# EAGLE design sub2 (EAGLE 4.13)
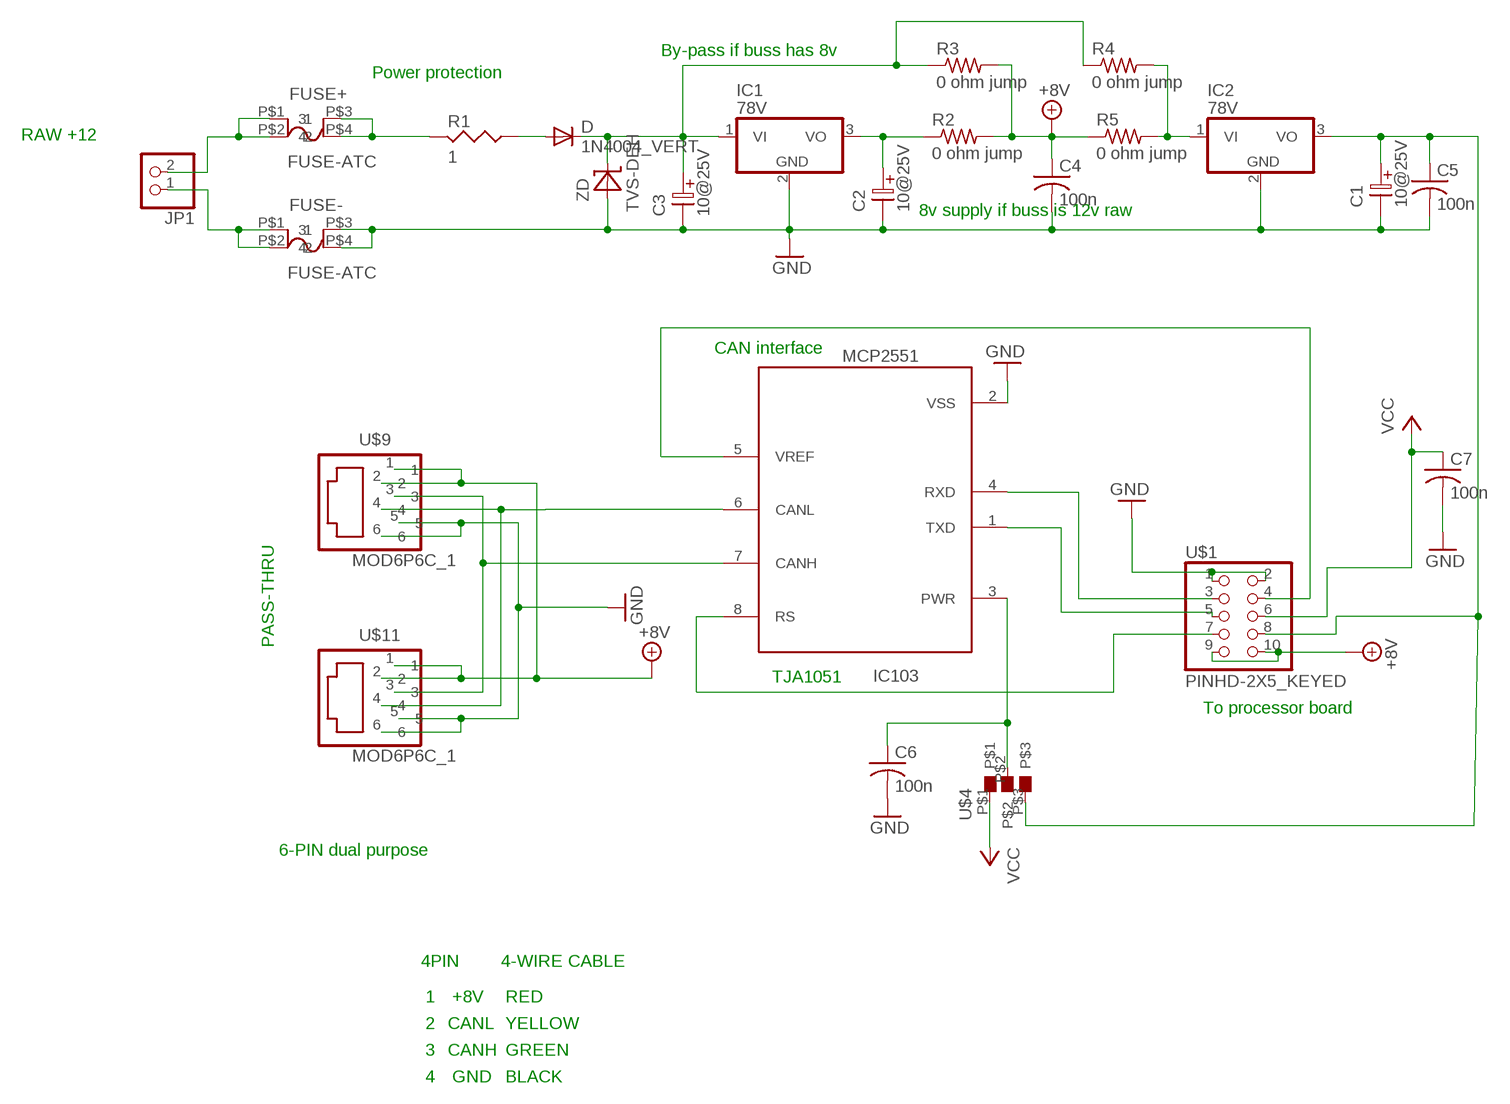
[diagram p0: schematic, sheet 1]

## Parts
C1  10@25V  ELC-2,5L  [ES-2,5L]
C2  10@25V  ELC-2,5L  [ES-2,5L]
C3  10@25V  ELC-2,5L  [ES-2,5L]
C4  100n  C-USC0603  [C0603]
C5  100n  C-USC0603  [C0603]
C6  100n  C-USC0603  [C0603]
C7  100n  C-USC0603  [C0603]
D  1N4004_VERT  [DO41-10_VERT]
FUSE+  FUSE-ATC  [ATC-FUSE]
FUSE-  FUSE-ATC  [ATC-FUSE]
IC1  78V  [TO220V]
IC2  78V  [TO220V]
IC103  MCP2551  [SO-08]
JP1  PINHD-1X2  [1X02]
R1  1  RESUS-S2,5  [RS-2,5]
R2  0 ohm jump  R-US_R0603  [R0603]
R3  0 ohm jump  R-US_R0603  [R0603]
R4  0 ohm jump  R-US_R0603  [R0603]
R5  0 ohm jump  R-US_R0603  [R0603]
U$1  PINHD-2X5_KEYED  [2X05_KEYED]
U$4  SMD-3  [SMD_3]
U$9  MOD6P6C_1  [MOD6P6C_1]
U$11  MOD6P6C_1  [MOD6P6C_1]
ZD  TVS-DEH  [TVS-DEH]

## Nets
5V_REG_VI: IC2.1(VI) R4.2 R5.2
12V_GND: FUSE-.P$1 FUSE-.P$2 JP1.1
12V_PLUS: FUSE+.P$1 FUSE+.P$2 JP1.2
+5V: C1.1 C5.1 IC2.3(VO) U$1.8 U$4.P$3
+8_REG: C2.1 IC1.3(VO) R2.1
+8V: C4.1 R2.2 R3.2 R5.1 U$1.9 U$1.10 U$9.1 U$9.2 U$11.1 U$11.2
+12V_RESISTORED: D.A R1.1
+12V_VI: C3.1 D.C IC1.1(VI) R3.1 R4.1 ZD.C
+12VFUSED: FUSE+.P$3 FUSE+.P$4 R1.2
CAN_DRVR_PWR: C6.1 IC103.3(PWR) U$4.P$2
CAN_RXD: IC103.4(RXD) U$1.3
CAN_TXD: IC103.1(TXD) U$1.5
CAN_VREF: IC103.5(VREF) U$1.4
CANH: IC103.7(CANH) U$9.3 U$11.3
CANL: IC103.6(CANL) U$9.4 U$11.4
GND: C1.2 C2.2 C3.2 C4.2 C5.2 C6.2 C7.2 FUSE-.P$3 FUSE-.P$4 IC1.2(GND) IC2.2(GND) IC103.2(VSS) U$1.1 U$1.2 U$9.5 U$9.6 U$11.5 U$11.6 ZD.A
PB7_CAN_RS: IC103.8(RS) U$1.7
VCC: C7.1 U$1.6 U$4.P$1

## Notes on the sheet
- By-pass if buss has 8v
- Power protection
- RAW +12
- 8v supply if buss is 12v raw
- CAN interface
- PASS-THRU
- TJA1051
- To processor board
- 6-PIN dual purpose
- 4PIN | 4-WIRE CABLE
- 1 | +8V | RED
- 2 | CANL | YELLOW
- 3 | CANH | GREEN
- 4 | GND | BLACK

## Library data of the parts
C1-C3 = DEH:ELC-2,5L
C4-C7 = rcl:C-US: CAPACITOR, American symbol
D = diode:1N4004_VERT
FUSE+ FUSE- = DEH:FUSE-ATC
IC1 IC2 = linear:78*: Positive VOLTAGE REGULATOR
IC103 = texas:MCP2551
JP1 = pinhead:PINHD-1X2: PIN HEADER
R1 = DEH:RESUS-S2,5
R2-R5 = rcl:R-US_: RESISTOR, American symbol
U$1 = pinhead:PINHD-2X5_KEYED
U$4 = solpad:SMD-3
U$9 U$11 = DEH:MOD6P6C_1
ZD = diode-1:TVS-DEH

## Board
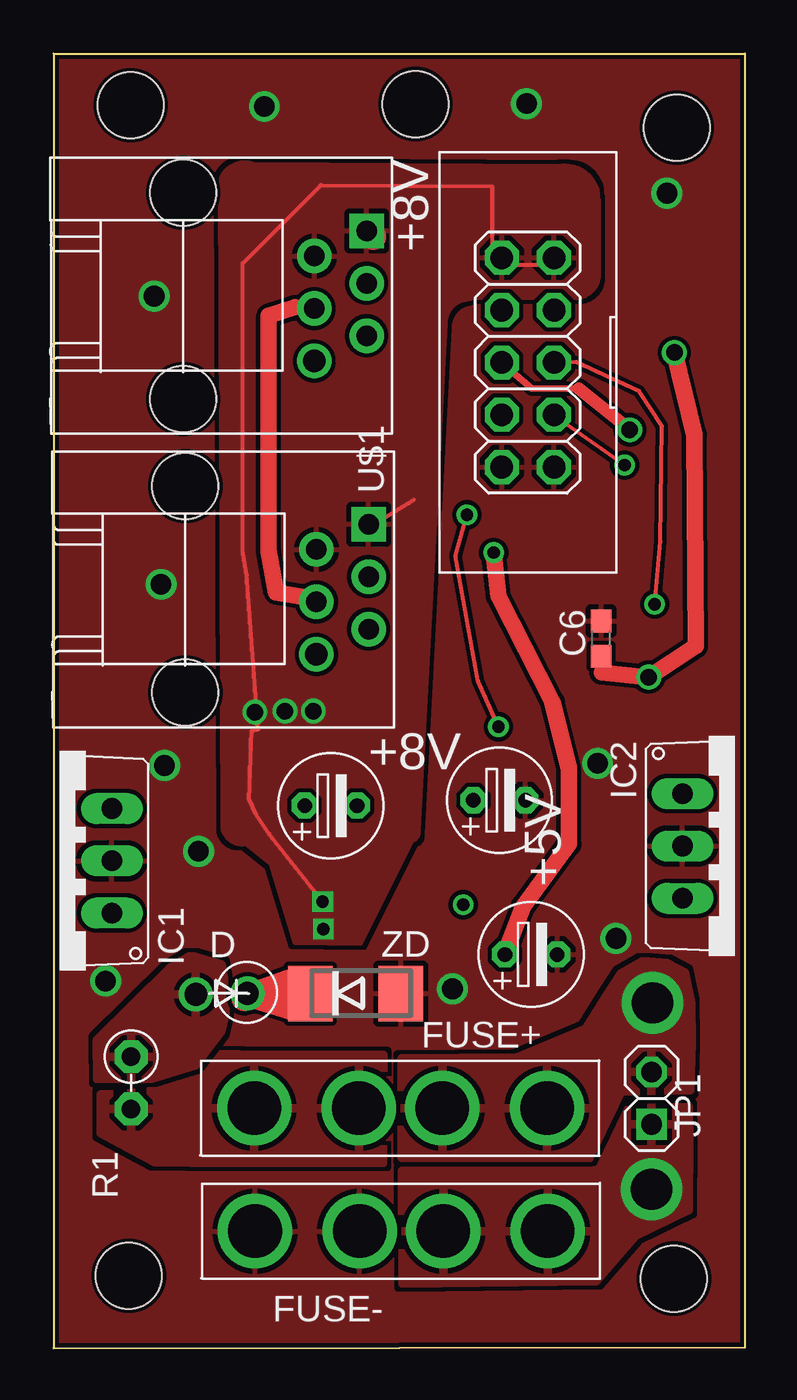
[diagram p1: board, top side]
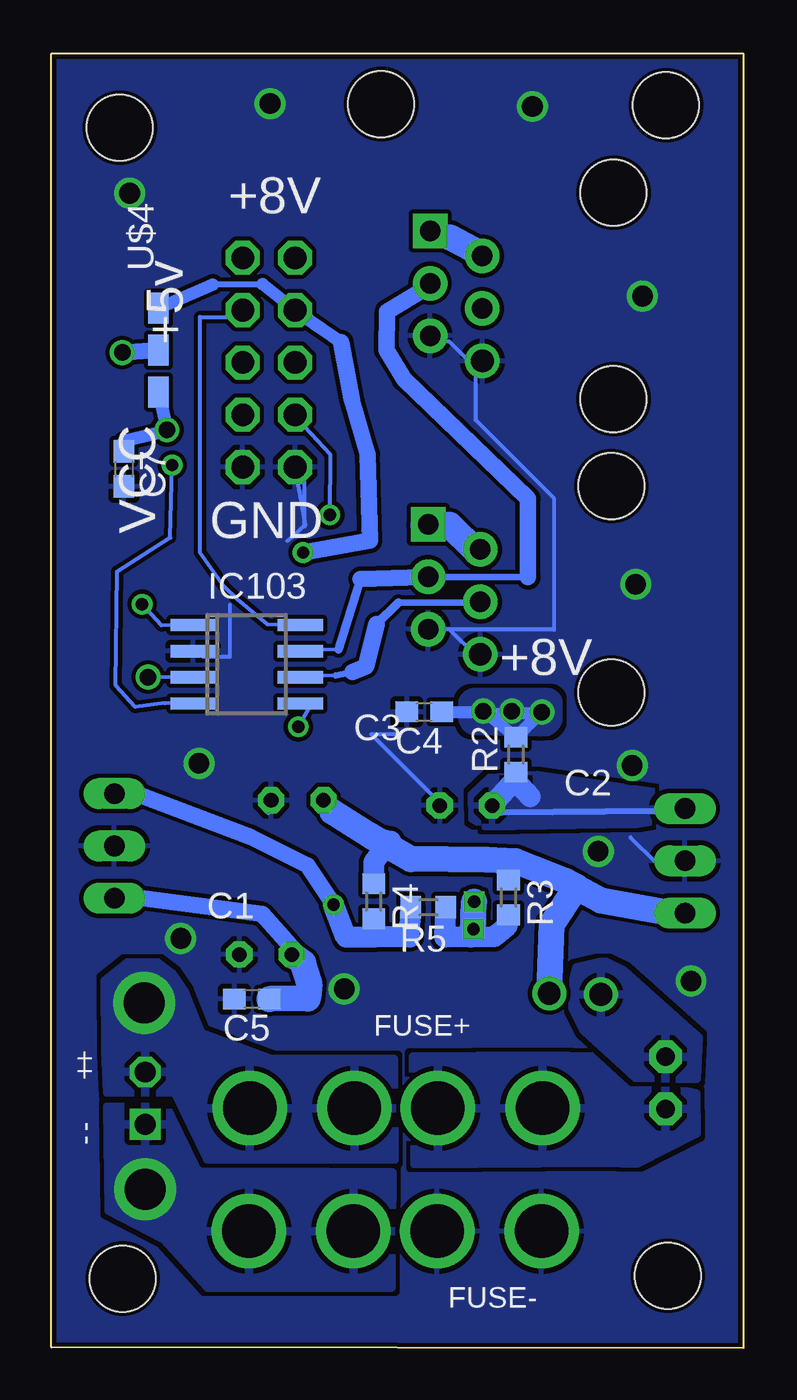
[diagram p2: board, bottom side, seen from below]

Size 33.6 x 62.86 mm. Coordinates in mm from the lower left corner, seen from the top.
Outline: 0,62.86 0,0 33.6,0.03 33.6,62.86 0,62.86
Copper layers (1*16): Top 0.035mm / dielectric 1.5mm / Bottom 0.035mm
Design rules "default": minimum track width 8mil, minimum drill 0.6mm, track to track 8mil, track to pad 8mil, pad to pad 8mil, via to via 8mil, smd to smd 0mil, copper to edge 8mil, drill to drill 8mil, minimum pad ring 8mil, minimum via ring 8mil, stop-mask expansion 4mil, vias tented up to drill 0mil, thermal gap 10mil
Holes 3.2 mm at 3.66,3.51 3.75,60.35 30.28,59.26 30.14,3.37 17.59,60.41

### Footprints (pad centres in the part's own frame; a part is rotated, then mirrored left to right if it is on the bottom)
ES-2,5L = drill 0.711 pad 1.27 octagon: 1 0,0; 2 2.54,0
C0603 = smd 1.1 x 1: 1 -0.85,0; 2 0.85,0
DO41-10_VERT = drill 1.1 round: A 2.58,0.05; C 0.07,0
ATC-FUSE = drill 2.6 round: P$1 -2.03,0; P$2 -7.11,0; P$3 2.03,0; P$4 7.11,0
TO220V = drill 1 long: 1 -2.54,1.27; 2 0,1.27; 3 2.54,1.27
SO-08 = smd 0.6 x 2.2: 1 -1.905,-2.6; 2 -0.635,-2.6; 3 0.635,-2.6; 4 1.905,-2.6; 5 1.905,2.6; 6 0.635,2.6; 7 -0.635,2.6; 8 -1.905,2.6
1X02 = drill 1 square: 1 -1.27,0 | drill 1 octagon: 2 1.27,0
RS-2,5 = drill 0.9 pad 1.6 octagon: 1 0,0; 2 2.54,0
R0603 = smd 1 x 1.1: 1 -0.85,0; 2 0.85,0
2X05_KEYED = drill 1.1 octagon: 1 -5.08,-1.27; 2 -5.08,1.27; 3 -2.54,-1.27; 4 -2.54,1.27; 5 0,-1.27; 6 0,1.27; 7 2.54,-1.27; 8 2.54,1.27; 9 5.08,-1.27; 10 5.08,1.27
SMD_3 = smd 1.5 x 1: P$1 -2.04,-0.27; P$2 0,-0.27; P$3 2.04,-0.27
MOD6P6C_1 = drill 1 pad 1.676 square: 1 -3.175,8.898 | drill 1 pad 1.676 round: 2 -1.951,6.358; 3 -0.627,8.898; 4 0.597,6.358; 5 1.921,8.898 | drill 1.1 pad 1.676 round: 6 3.145,6.358 | hole 3.2: -5.029,-0.01; 4.999,-0.01
TVS-DEH = smd 2.16 x 2.7: A 2.19,-0.05; C -2.2,-0.05

### Placement (x,y rotation side)
C1  21.93,19.11 0 top
C2  12.2,26.34 0 top
C3  20.39,26.6 0 top
C4  15.49,30.89 180 bottom
C5  23.86,16.95 180 bottom
C6  26.6,34.45 90 top
C7  30.09,42.69 270 bottom
D  9.49,17.22 180 top
FUSE+  16.86,11.64 180 top
FUSE-  16.9,5.67 180 top
IC1  4.1,23.66 90 top
IC2  29.28,24.38 270 top
IC103  24.12,33.21 270 bottom
JP1  29.05,12.13 90 top
R1  3.77,14.15 270 top
R2  11.04,28.82 90 bottom
R3  11.4,21.88 270 bottom
R4  17.95,21.69 270 bottom
R5  15.29,21.4 180 bottom
U$1  23.04,47.86 90 top
U$4  28.67,48.46 90 bottom
U$9  6.41,36.83 270 top
U$11  6.31,51.08 270 top
ZD  14.68,17.26 0 top

### Tracks (layer width: path | path; a pad name or v marks a point on that pad's centre or on a via)
5V_REG_VI  (via drill 0.6)
  Bottom 0.813: v19.9,21.53 21.16,23.44 23.93,24.83 29.31,26.86 IC2.1
  Bottom 1.016: 17.92,19.95 R4.2 | 17.92,19.95 19.28,19.95 19.89,21.51 v19.9,21.53 | R5.2 16.2,19.96 17.92,19.97 17.92,19.95
12V_GND  (via drill 2)
  other vias: 29.05,7.71
  pour Top (rank 3): 27.89,11.67 26.3,8.6 16.93,8.6 16.96,3.12 26.38,3.25 28.27,5.43 30.87,6.68 30.88,10.24 30.86,11.72
  pour Bottom (rank 3): 17.03,8.54 26.29,8.6 27.95,11.71 30.89,11.73 30.82,6.67 28.16,5.29 25.99,2.9 17.09,2.93
12V_PLUS  (via drill 2)
  other vias: 29.1,16.76
  pour Top: 30.92,12.51 27.59,12.44 26.02,9.21 16.9,9.24 16.9,14.07 22.49,14.11 25.87,15.51 26.87,17.16 27.56,18.18 28.62,18.8 29.79,18.71 30.66,18.24 30.99,16.74 31,14.85
  pour Bottom (rank 2): 16.97,14.04 23.02,14.07 26.31,15.28 27.09,17.23 27.76,18.21 28.45,18.72 29.92,18.72 31.02,17.86 30.98,14.43 30.9,12.4 27.62,12.41 26.04,9.17 16.94,9.14
+5V  (via drill 0.6)
  Top 0.203: C1.1 21.96,19.21
  Top 0.813: v21.38,38.63 21.61,36.51 24.24,31.36 25.03,28.14 25.04,24.47 22.8,21.43 21.96,19.21
  Bottom 0.203: C1.1 22.01,19.54 | 30.38,22 IC2.3 | 21.3,50.07 U$1.8 21.79,50.43
  Bottom 0.305: 23.35,51.66 25.77,51.64
  Bottom 0.61: 19.53,48.84 21.3,50.07 | 25.77,51.64 U$4.P$3 | 21.79,50.43 23.35,51.66
  Bottom 0.813: 22.01,19.54 23.37,21.08 30.38,22 | 19.53,48.84 18.99,46 18.24,43.41 18.13,39.2 v21.38,38.63
  Bottom 1.27: C5.1 21.14,16.97 21.07,17.71 21.37,18.71 C1.1
+8_REG
  Bottom 0.203: 11.72,26 C2.1 | IC1.3 4.2,26.07 | 10.34,26.77 R2.1
  Bottom 0.305: 4.2,26.07 11.72,26
  Bottom 1.016: C2.1 11.08,27.59 10.34,26.77
  pour Bottom: 3.88,25.63 5.17,25.4 12.55,25.28 13.21,25.67 13.22,26.91 12.35,27.74 10.03,27.87 4.16,27.02 3.73,26.43
+8V  (via drill 0.6, 0.8)
  Top 0.203: 9.94,30.06 9.39,37.55 9.18,38.7 9.18,52.67 12.99,56.48 21.3,56.42 21.3,52.61 U$1.10 22.57,52.61 23.84,52.61 U$1.9 | 9.94,30.06 v9.78,30.88 | 17.49,41.18 15.53,39.97 U$9.1 | 9.94,30.06 9.63,29.96 9.5,26.63 9.85,25.91 10.48,24.97 v13.07,21.68
  Top 1.27: U$11.1 15.54,53.95
  Bottom 0.203: U$9.2 12.99,38.7 | 15.53,39.97 U$9.1 | 14.26,53.94 15.53,53.94 U$11.1 | 13.23,19.95 13.12,20.17 13.12,20.19 v13.1,20.34
  Bottom 0.61: v9.78,30.88 R2.2 12.45,30.78 9.63,30.84 | v12.62,30.93 12.55,30.86 C4.1
  Bottom 1.016: R5.1 14.49,19.96 13.23,19.95 12.1,19.97 11.46,20.5 R3.2
  Bottom 1.27: 12.99,38.7 14.26,39.97 15.53,39.97 | 14.26,53.94 12.86,53.19 U$11.2 | 13.12,20.17 v13.07,21.68
  other vias: 11.24,30.93
  pour Top (rank 4): 9.66,57.52 24.56,57.41 arc-90 26.44,56.08 26.44,55.77 26.49,55.77 26.49,52.14 arc-90 25.33,50.98 20.24,50.98 20.24,50.93 arc90 19.03,49.72 17.72,25.14 arc-90 17.42,24.63 14.9,19.61 11.74,19.65 10.57,23.49 9.32,24.48 arc-90 8.22,25.22 8.1,56.71 arc-90
  pour Bottom (rank 4): 9.82,30 arc-90 9.07,30.55 9.06,31.28 arc-90 9.5,31.75 13.06,31.75 arc-90 13.56,31.23 13.53,30.54 arc-90 12.95,30.06
+12V_RESISTORED
  pour Bottom: 2.15,15.09 5.79,18.33 6.75,18.79 8.1,18.48 8.49,16.87 7.73,15.4 5.23,13.11 3.38,13.08 2.25,13.07
  pour Top: 2.1,14.95 5.69,18.48 6.67,19.06 8.16,18.62 8.47,16.8 8.14,15.36 6.91,13.72 4.76,13.06 2.11,13.05
+12V_VI
  Top 1.27: ZD.C 12.32,17.76 11.49,17.78 | 11.49,17.78 9.26,16.98 | 11.49,17.78 11.63,16.53 D.C
  Bottom 0.61: 19.95,26.04 C3.1 | 3.78,21.17 IC1.1
  Bottom 1.016: 12.47,23.7 11.19,23.75 R3.1 | R4.1 17.95,23.57 17.12,24.62 18.09,24.87
  Bottom 1.27: 19.95,26.04 18.09,24.87 16.15,23.75 12.47,23.7 11.05,23.64 8.64,22.69 8.1,22.39 | 3.78,21.17 6.9,21.73 8.1,22.39 | D.C 9.29,20.58 8.11,22.37 8.1,22.39
+12VFUSED
  pour Top (rank 2): 2.28,12.31 3.44,12.37 4.89,12.5 5.58,12.9 6.43,14.21 7.14,14.26 9.03,14.26 9.82,14.23 16.04,14.23 16.01,8.97 6.65,9 4.91,9.01 2.28,10.42
  pour Bottom (rank 2): 16.03,14.16 15.97,8.93 6.75,8.99 5.16,8.94 2.26,10.42 2.27,12.36 4.8,12.91 5.79,13.09 6.99,14.16 9.87,14.22
CAN_DRVR_PWR  (via drill 0.8)
  Top 0.406: 26.63,32.81 C6.1 | v28.91,32.58 28.94,32.56
  Top 0.813: v28.91,32.58 31.19,34.08 31.13,44.35 v30.16,48.34 | 28.94,32.56 26.63,32.81
  Bottom 0.203: IC103.3 v28.91,32.58 | 28.51,48.45 U$4.P$2
  Bottom 0.813: v30.16,48.34 28.51,48.45
CAN_RXD  (via drill 0.6)
  Top 0.203: U$1.3 24.23,45.33 v27.74,42.88
  Bottom 0.203: IC103.4 28.1,31.32 29.53,31.13 30.47,32.17 30.42,37.7 27.83,39.35 v27.74,42.88
CAN_TXD  (via drill 0.6)
  Top 0.203: v29.2,36.12 29.48,39.17 29.55,44.76 28.44,46.48 25.39,47.88 U$1.5
  Bottom 0.203: v29.2,36.12 28.26,35.09 IC103.1
CAN_VREF  (via drill 0.6)
  Top 0.203: v21.61,30.17 20.62,32.4 19.53,38.46 v20.08,40.46
  Bottom 0.203: v21.61,30.17 21.12,31.02 IC103.5 | v20.08,40.46 20.05,43.38 21.3,44.74 U$1.4
CANH
  Bottom 0.203: 19.65,33.91 21.14,33.89 IC103.7 | 15.53,37.43 U$9.3
  Bottom 0.305: 10.45,37.43 15.53,37.43 | 15.53,51.4 U$11.3
  Bottom 0.406: 18.58,37.35 19.65,33.91
  Bottom 0.813: 15.53,37.43 18.58,37.35 | 15.53,51.4 17.3,50.33 17.33,48.47 16.48,47.04 10.45,41.24 10.45,37.43
CANL
  Top 0.203: 12.6,36.4 U$9.4
  Top 0.406: 11.73,50.54 U$11.4
  Top 0.813: 11.73,50.54 10.45,50.13 10.45,38.7 10.82,36.69 12.6,36.4
  Bottom 0.203: 19.8,32.65 21.09,32.6 IC103.6 | U$9.4 13.01,36.2
  Bottom 0.305: 18.98,32.82 19.8,32.65 | 13.01,36.2 16.74,36.2
  Bottom 0.406: 16.74,36.2 17.8,35.15
  Bottom 0.813: 18.98,32.82 18.33,33.1 17.8,35.15
GND  (via drill 1)
  Bottom 0.203: C3.2 23.06,25.97 | 30.27,25.04 IC2.2 | 21.3,39.91 21.3,42.45 U$1.2 | 12.99,47.59 14.26,48.86 15.53,48.86 U$11.5 | 14.26,34.89 12.99,33.62 U$9.6 | 14.26,34.89 15.53,34.89 U$9.5 | IC103.2 26.2,33.56 24.93,33.56 24.93,36.1 | 5.47,24.8 4.2,23.53 IC1.2 | C2.2 14.28,26.02 18.07,29.81 16.8,29.81 | 12.99,47.59 12.99,45.05 9.18,41.24 9.18,34.89 14.26,34.89 | 12.99,47.59 U$11.6 | 22.14,39.19 21.26,40 21.76,42.84
  other vias: 19.38,17.44 26.43,28.39 5.39,28.29 2.53,17.82 7.04,24.12 10.24,60.29 22.98,60.43 29.8,56.08 4.89,51.08 5.22,37.09 27.32,19.89
  pour Bottom (rank 5): 0,0 0,62.86 33.62,62.86 33.62,-0.01
  pour Top (rank 5): 0,0 0,62.86 33.61,62.87 33.6,0.02
N$2
  Bottom 0.1: 0,62.86 31.19,62.86
PB7_CAN_RS
  Bottom 0.203: IC103.8 23.11,35.14 24.55,36.34 25.18,36.95 26.38,38.64 26.38,50.07 25.11,50.07 U$1.7
VCC  (via drill 0.8)
  Top 0.203: 21.3,47.53 U$1.6 21.79,47.82
  Top 0.305: 25.52,46.59 23.24,46.59 21.79,47.82
  Top 0.61: 25.52,46.59 v27.99,44.59
  Bottom 0.406: 30.09,44.03 C7.1 | v27.99,44.59 28.16,44.5
  Bottom 0.61: v27.99,44.59 U$4.P$1 | 28.16,44.5 30.09,44.03

### Text on the board
tNames: +8V | +8V | +5V
bNames: +8V | +5v | VCC | GND | +8V | FUSE+ | + | + | - | - | FUSE-